# Altium schematic sheet linkit-v4.SchDoc
size A4; Organization: Arribada Initiative; Address1: https://github.com/arribada; Address2: contact@arribada.org; Address3: arribada.org; Address4: UK - Portsmouth; DocumentNumber: 2; SheetNumber: 2; SheetTotal: 13
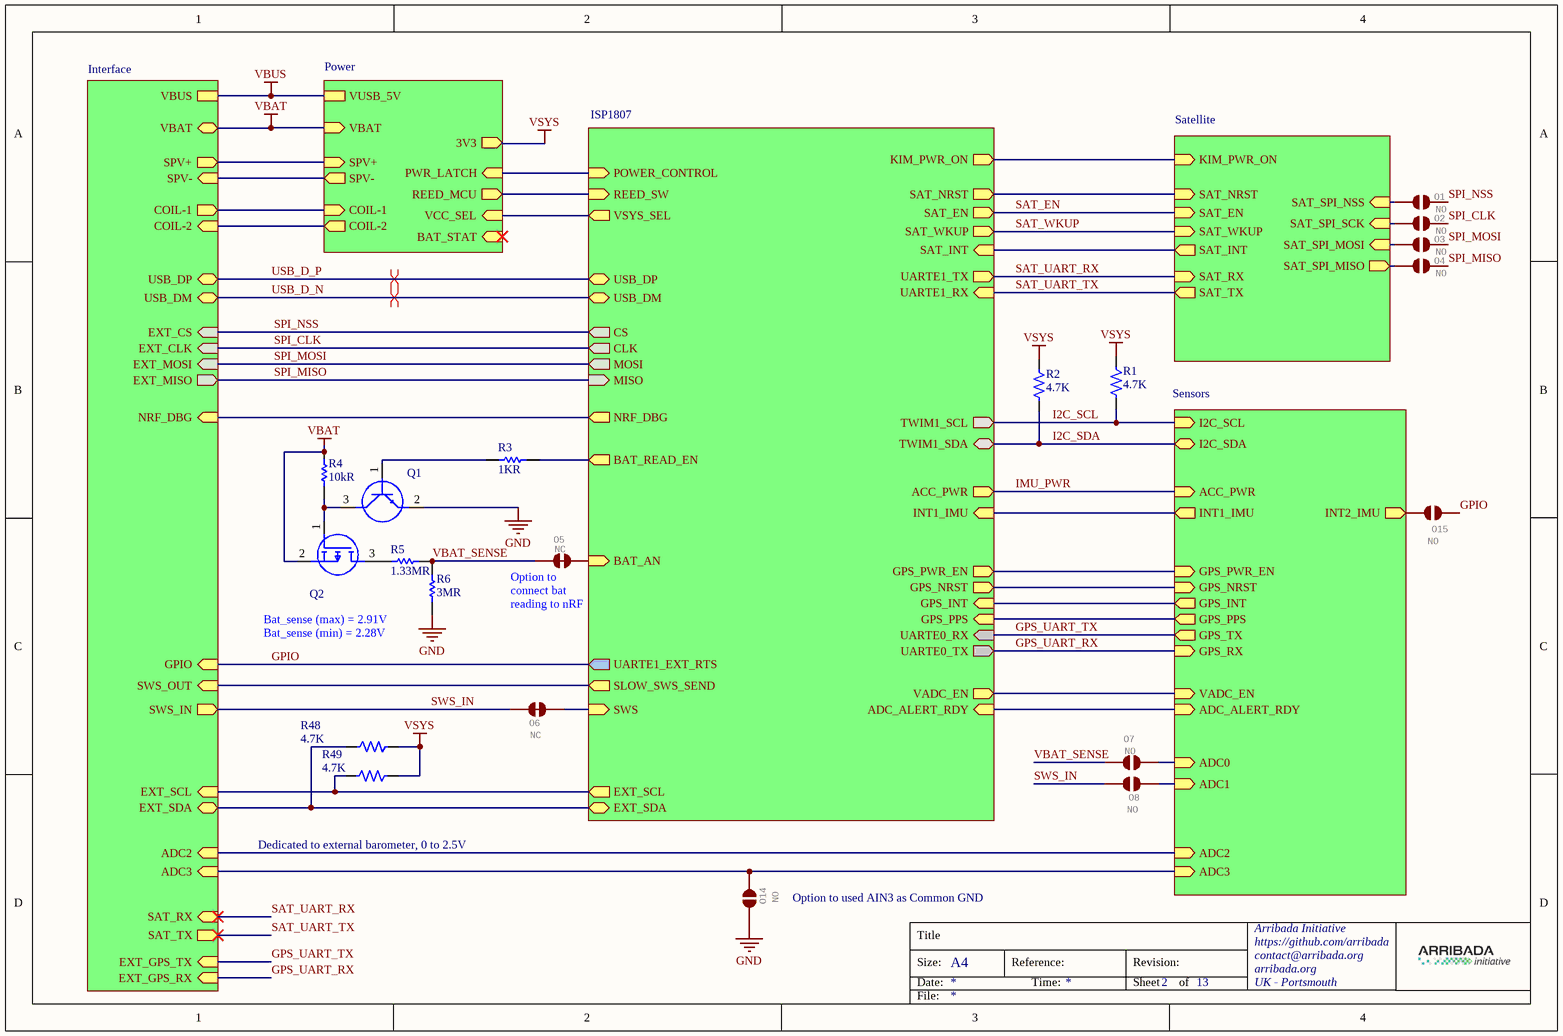
[diagram p0: linkit-v4.SchDoc]

## Parts
O1  NO  [SMT-JUMPER_2_NO_TRACE_SILK]  (net tie, no BOM)
O2  NO  [SMT-JUMPER_2_NO_TRACE_SILK]  (net tie, no BOM)
O3  NO  [SMT-JUMPER_2_NO_TRACE_SILK]  (net tie, no BOM)
O4  NO  [SMT-JUMPER_2_NO_TRACE_SILK]  (net tie, no BOM)
O5  NC  [SMT-JUMPER_2_NC_TRACE_SILK]  (net tie, no BOM)
O6  NC  [SMT-JUMPER_2_NC_TRACE_SILK]  (net tie, no BOM)
O7  NO  [SMT-JUMPER_2_NO_TRACE_SILK]  (net tie, no BOM)
O8  NO  [SMT-JUMPER_2_NO_TRACE_SILK]  (net tie, no BOM)
O14  NO  [SMT-JUMPER_2_NO_TRACE_SILK]  (net tie, no BOM)
O15  NO  [SMT-JUMPER_2_NO_TRACE_SILK]  (net tie, no BOM)
Q1  MMBT3904LT1G  [SOT96P237X111-3N]  (value not drawn)
Q2  DMP2305U-7  [SOT96P240X115-3N]  (value not drawn)
R1  value 4.7K  [RES0201L]  (hidden comment: 4.7K 0201 1% 100PPM)
R2  value 4.7K  [RES0201L]  (hidden comment: 4.7K 0201 1% 100PPM)
R3  1kR  [RESC0603X28N]
R4  value 10kR  [RESC1005X40N]  (hidden comment: CRCW040210K0JNEDC)
R5  value 1.33MR  [RESC2012X60N]  (hidden comment: RT0805BRD071M33L)
R6  value 3MR  [RESC3216X55N]  (hidden comment: RGV3216P-3004-B-T1)
R48  value 4.7K  [RES0201L]  (hidden comment: 4.7K 0201 1% 100PPM)
R49  value 4.7K  [RES0201L]  (hidden comment: 4.7K 0201 1% 100PPM)

## Sub-sheets
Interface = interface.SchDoc: USB_DP (bidir), USB_DM (bidir), VBUS, COIL-1 (out), COIL-2 (in), SWS_OUT (in), SWS_IN (out), EXT_CS (in), EXT_CLK (in), EXT_MISO (out), EXT_MOSI (in), NRF_DBG (in), ADC2 (in), EXT_SCL (in), EXT_SDA (bidir), VBAT (bidir), SAT_RX (in), SAT_TX (out), EXT_GPS_TX (in), EXT_GPS_RX (in), ADC3 (in), GPIO (in), SPV+ (out), SPV- (in)
ISP1807 = mcu.SchDoc: REED_SW (in), USB_DM (bidir), USB_DP (bidir), UARTE0_TX (out), UARTE0_RX (in), TWIM1_SCL (out), TWIM1_SDA (bidir), SWS (in), GPS_INT (in), UARTE1_EXT_RTS (out), VSYS_SEL (out), GPS_NRST (out), ADC_ALERT_RDY (in), CS (out), CLK (out), MISO (in), MOSI (out), SAT_NRST (out), SAT_INT (in), SAT_WKUP (out), SAT_EN (out), GPS_PWR_EN (out), BAT_AN (in), POWER_CONTROL (in), KIM_PWR_ON (out), SLOW_SWS_SEND (out), GPS_PPS (in), NRF_DBG (out), INT1_IMU (in), ACC_PWR (out), VADC_EN (out), BAT_READ_EN (out), UARTE1_TX (out), UARTE1_RX (in), EXT_SCL (out), EXT_SDA (bidir)
Power = pwr.SchDoc: VBAT (in), VCC_SEL (in), COIL-1 (in), COIL-2 (out), VUSB_5V, 3V3 (out), REED_MCU (out), PWR_LATCH (in), BAT_STAT (in), SPV+ (in), SPV- (out)
Satellite = satellite.SchDoc: SAT_RX (in), SAT_TX (out), SAT_WKUP (in), SAT_INT (out), SAT_EN (in), SAT_NRST (in), SAT_SPI_MISO (out), SAT_SPI_MOSI (in), SAT_SPI_NSS (in), SAT_SPI_SCK (in), KIM_PWR_ON (in)
Sensors = sensors.SchDoc: ADC0 (in), ADC1 (in), ADC2 (in), ADC_ALERT_RDY (in), VADC_EN (in), GPS_PWR_EN (in), GPS_RX (in), GPS_TX (out), GPS_NRST (in), GPS_INT (out), GPS_PPS (out), ACC_PWR (in), INT1_IMU (out), I2C_SCL (in), I2C_SDA (bidir), ADC3 (in), INT2_IMU (out)

## Nets
GND: O14.1 Q1.2(E) R6.2
VBAT: Q2.2(S) R4.1 ; sheet Interface/VBAT, sheet Power/VBAT
VBUS: sheet Interface/VBUS, sheet Power/VUSB_5V
VSYS: R1.2 R2.2 R48.2 R49.1 ; sheet Power/3V3
GPIO: O15.1 ; sheet ISP1807/UARTE1_EXT_RTS, sheet Interface/GPIO
GPS_UART_RX: sheet ISP1807/UARTE0_TX, sheet Sensors/GPS_RX, sheet Interface/EXT_GPS_RX
GPS_UART_TX: sheet ISP1807/UARTE0_RX, sheet Sensors/GPS_TX, sheet Interface/EXT_GPS_TX
I2C_SCL: R1.1 ; sheet ISP1807/TWIM1_SCL, sheet Sensors/I2C_SCL
I2C_SDA: R2.1 ; sheet ISP1807/TWIM1_SDA, sheet Sensors/I2C_SDA
IMU_PWR: sheet ISP1807/ACC_PWR, sheet Sensors/ACC_PWR
SAT_EN: sheet ISP1807/SAT_EN, sheet Satellite/SAT_EN
SAT_UART_RX: sheet ISP1807/UARTE1_TX, sheet Interface/SAT_RX, sheet Satellite/SAT_RX
SAT_UART_TX: sheet ISP1807/UARTE1_RX, sheet Interface/SAT_TX, sheet Satellite/SAT_TX
SAT_WKUP: sheet ISP1807/SAT_WKUP, sheet Satellite/SAT_WKUP
SPI_CLK: O2.2 ; sheet ISP1807/CLK, sheet Interface/EXT_CLK
SPI_MISO: O4.2 ; sheet ISP1807/MISO, sheet Interface/EXT_MISO
SPI_MOSI: O3.2 ; sheet ISP1807/MOSI, sheet Interface/EXT_MOSI
SPI_NSS: O1.2 ; sheet ISP1807/CS, sheet Interface/EXT_CS
SWS_IN: O6.1 O8.1 ; sheet Interface/SWS_IN
USB_D_N: sheet ISP1807/USB_DM, sheet Interface/USB_DM
USB_D_P: sheet ISP1807/USB_DP, sheet Interface/USB_DP
VBAT_SENSE: O5.1 O7.1 R5.2 R6.1
NetO1_1: O1.1 ; sheet Satellite/SAT_SPI_NSS
NetO2_1: O2.1 ; sheet Satellite/SAT_SPI_SCK
NetO3_1: O3.1 ; sheet Satellite/SAT_SPI_MOSI
NetO4_1: O4.1 ; sheet Satellite/SAT_SPI_MISO
NetO5_2: O5.2 ; sheet ISP1807/BAT_AN
NetO6_2: O6.2 ; sheet ISP1807/SWS
NetO7_2: O7.2 ; sheet Sensors/ADC0
NetO8_2: O8.2 ; sheet Sensors/ADC1
NetO14_2: O14.2 ; sheet Sensors/ADC3, sheet Interface/ADC3
NetO15_2: O15.2 ; sheet Sensors/INT2_IMU
NetQ1_1: Q1.1(B) R3.1
NetQ1_3: Q1.3(C) Q2.1(G) R4.2
NetQ2_3: Q2.3(D) R5.1
NetR3_2: R3.2 ; sheet ISP1807/BAT_READ_EN
NetR48_1: R48.1 ; sheet ISP1807/EXT_SDA, sheet Interface/EXT_SDA
NetR49_2: R49.2 ; sheet ISP1807/EXT_SCL, sheet Interface/EXT_SCL
(unnamed): sheet ISP1807/REED_SW, sheet Power/REED_MCU
(unnamed): sheet ISP1807/GPS_INT, sheet Sensors/GPS_INT
(unnamed): sheet ISP1807/VSYS_SEL, sheet Power/VCC_SEL
(unnamed): sheet ISP1807/GPS_NRST, sheet Sensors/GPS_NRST
(unnamed): sheet ISP1807/ADC_ALERT_RDY, sheet Sensors/ADC_ALERT_RDY
(unnamed): sheet ISP1807/SAT_NRST, sheet Satellite/SAT_NRST
(unnamed): sheet ISP1807/SAT_INT, sheet Satellite/SAT_INT
(unnamed): sheet ISP1807/GPS_PWR_EN, sheet Sensors/GPS_PWR_EN
(unnamed): sheet ISP1807/POWER_CONTROL, sheet Power/PWR_LATCH
(unnamed): sheet ISP1807/KIM_PWR_ON, sheet Satellite/KIM_PWR_ON
(unnamed): sheet ISP1807/SLOW_SWS_SEND, sheet Interface/SWS_OUT
(unnamed): sheet ISP1807/GPS_PPS, sheet Sensors/GPS_PPS
(unnamed): sheet ISP1807/NRF_DBG, sheet Interface/NRF_DBG
(unnamed): sheet ISP1807/INT1_IMU, sheet Sensors/INT1_IMU
(unnamed): sheet ISP1807/VADC_EN, sheet Sensors/VADC_EN
(unnamed): sheet Sensors/ADC2, sheet Interface/ADC2
(unnamed): sheet Interface/COIL-1, sheet Power/COIL-1
(unnamed): sheet Interface/COIL-2, sheet Power/COIL-2
(unnamed): sheet Interface/SPV+, sheet Power/SPV+
(unnamed): sheet Interface/SPV-, sheet Power/SPV-

## Layout directives
differential pair; rule Impedance Constraint [Min = 80.00    Max = 100.0    ]; differential pair class USB: USB_D_N, USB_D_P

## Notes on the sheet
- Bat_sense (max) = 2.91V
  Bat_sense (min) = 2.28V
- Type @ to refer to a designator
- (near O5) Option to connect bat reading to nRF
- Dedicated to external barometer, 0 to 2.5V
- (near O14) Option to used AIN3 as Common GND
- Title
- Size:
- Date:
- A4
- Reference:
- Time:
- Revision:
- Sheet
- of
- File:

## Library data of the parts
O1-O4 O7 O8 O14 O15 = JUMPER-SMT_2_NO_TRACE_SILK_1: Normally opened trace jumper / This jumper has no trace between two pads so it's normally closed (NO).; GateName_1: G$1; SymbolName_1: SMT-JUMPER_2_NC_TRACE; DeviceName: _SILK; DeviceSetName: JUMPER-SMT_2_NC_TRACE; LibraryName: SparkFun-Jumpers
O5 O6 = JUMPER-SMT_2_NC_TRACE_SILK: Normally closed trace jumper    This jumper has a trace between two pads so it's normally closed (NC). Use a razor knife to open the connection. For best results follow the IPC guidelines for cutting traces: Cutout at least 0.063 mm (0.005 in).  Remove all loose material to clean up the cut area.  Seal the cut with an approved epoxy.       Reapply solder to reclose the connection.; GateName_1: G$1; SymbolName_1: SMT-JUMPER_2_NC_TRACE; DeviceName: _SILK; LibraryName: SparkFun-Jumpers; DeviceSetName: JUMPER-SMT_2_NC_TRACE
Q1 = MMBT3904LT1G: Bipolar Transistors - BJT NPN GENERAL PURPOSE; Manufacturer_Name: onsemi; Datasheet Link: https://www.onsemi.com/pub/Collateral/MMBT3904LT1-D.PDF; Height: 1.11mm; Manufacturer_Part_Number: MMBT3904LT1G; Mouser Part Number: 863-MMBT3904LT1G; Mouser Price/Stock: https://www.mouser.co.uk/ProductDetail/onsemi/MMBT3904LT1G?qs=HVbQlW5zcXUYZ2Fy0YF3FQ%3D%3D; Arrow Part Number: MMBT3904LT1G; Arrow Price/Stock: https://www.arrow.com/en/products/mmbt3904lt1g/on-semiconductor?utm_currency=USD&region=europe
Q2 = DMP2305U-7: MOSFET P-CHANNEL ENHANCEMENT MODE; Manufacturer_Name: Diodes Incorporated; Datasheet Link: https://www.diodes.com//assets/Datasheets/DMP2305U.pdf; Height: 1.15mm; Manufacturer_Part_Number: DMP2305U-7; Mouser Part Number: 621-DMP2305U-7; Mouser Price/Stock: https://www.mouser.co.uk/ProductDetail/Diodes-Incorporated/DMP2305U-7?qs=oUsD4qhOtFyFQmlG8wLVjw%3D%3D; Arrow Part Number: DMP2305U-7; Arrow Price/Stock: https://www.arrow.com/en/products/dmp2305u-7/diodes-incorporated?utm_currency=USD&region=nac
R1 R2 R48 R49 = RES 4.7K 0201 1% 100PPM: PPM: 100; Manufacturer: *; Manufacturers Part Number: *; Tolerance: 1%; Size: 0201; Supplier 1: Mouser; Supplier 2: Digi-Key; Supplier Part Number 1: 71-CRCW02014K70FKED; Supplier Part Number 2: 541-4.70KAABCT-ND
R3 = CRCW02011K00FNED: Thick Film Resistors - SMD 1/20watt 1Kohms 1% 200ppm; Manufacturer_Name: Vishay; Datasheet Link: http://www.vishay.com/docs/20035/dcrcwe3.pdf; Height: 0.28mm; Manufacturer_Part_Number: CRCW02011K00FNED; Mouser Part Number: 71-CRCW02011K00FNED; Mouser Price/Stock: https://www.mouser.co.uk/ProductDetail/Vishay-Dale/CRCW02011K00FNED?qs=IQLUlsvFoXtTp7ngtIXo7A%3D%3D; Arrow Part Number: CRCW02011K00FNED; Arrow Price/Stock: https://www.arrow.com/en/products/crcw02011k00fned/vishay?region=nac; Value: 1KR
R4 = CRCW040210K0JNEDC: Thick Film Resistors - SMD 1/16watt 10Kohms 5% Commercial Use; Manufacturer: Vishay Semiconductors; Power Rating: 63mW; Voltage Rating: 50V; Supplier 1: Mouser; Manufacturer Part Number: CRCW040210K0JNEDC; RoHS: Yes; Category: Chip SMD Resistors; Stock 1: 229087; Pricing 1: 1=0,1, 10=0,013, 50=0,013, 100=0,007, 1000=0,005, 10000=0,004 (USD); Case/Package: 343Case; Resistance: 10kR; Tolerance: 5%; Height: 350um; Lead Free: 5697LeadFree; ComponentLink1URL: http://www.vishay.com/docs/28773/crcwce3.pdf?src-supplier=Digikey; ComponentLink1Description: http://www.vishay.com/docs/28773/crcwce3.pdf?src-supplier=Digikey; ComponentLink2URL: https://datasheet.octopart.com/CRCW040210K0JNEDC-Vishay-datasheet-100063072.pdf?src-supplier=Future+Electronics; ComponentLink2Description: https://datasheet.octopart.com/CRCW040210K0JNEDC-Vishay-datasheet-100063072.pdf?src-supplier=Future+Electronics; Supplier Part Number 1: 71-CRCW040210K0JNEDC
R5 = RT0805BRD071M33L: Thin Film Resistors - SMD 1/8W 1.33M Ohms 0.1%; Manufacturer: Yageo; Power Rating: 125mW; Temperature Coefficient: 25ppm/°C; Voltage Rating: 150V; Supplier: Mouser; Supplier Part Number: 603-RT0805BRD071M33L; Manufacturer Part Number: RT0805BRD071M33L; RoHS: Yes; Category: Chip SMD Resistors; Stock: 4964; Pricing: 1=0,19, 10=0,135, 50=0,108, 100=0,097, 1000=0,065, 10000=0,043 (USD); Case/Package: 339Case; Min Operating Temperature: -55°C; Max Operating Temperature: 155°C; Packaging: 10Packaging; Height: 600um; RoHS Compliant: Yes
R6 = RGV3216P-3004-B-T1: Thin Film Resistors - SMD Thin Film Chip Resistors 1206 size, 700V, 0.25W, 3.0M ohm, 0.1%, 25ppm AEC Q200; Manufacturer_Name: Susumu; Datasheet Link: https://www.mouser.in/datasheet/2/392/n_catalog_partition39_en-1919331.pdf; Height: 0.55mm; Manufacturer_Part_Number: RGV3216P-3004-B-T1